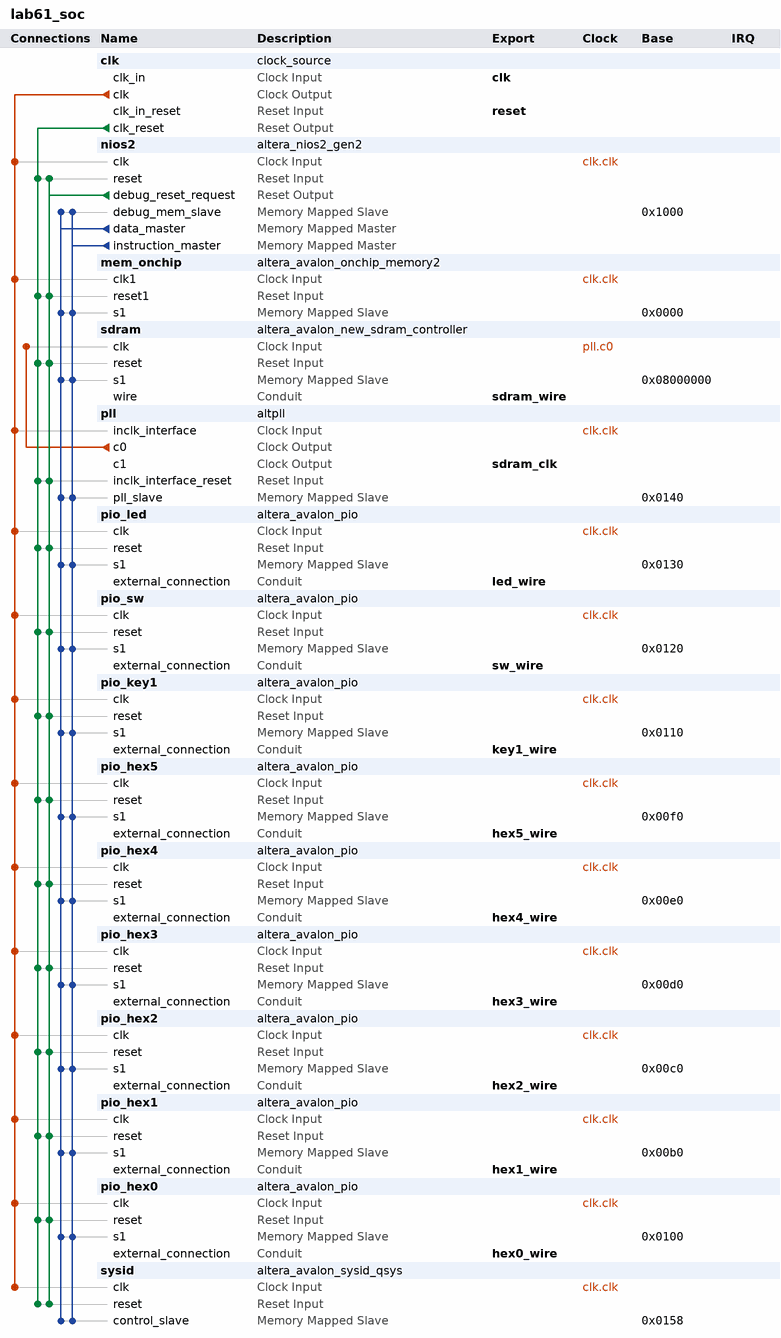
[diagram p0: system contents]
# Platform Designer (Qsys) system lab61_soc, MAX 10 10M50DAF484C7G
# Parameters at their usual value, and those the tool derives, are not listed.
package require -exact qsys 18.1
create_system lab61_soc
set_project_property DEVICE_FAMILY {MAX 10}
set_project_property DEVICE 10M50DAF484C7G

add_instance clk clock_source 18.1
set_instance_parameter_value clk clockFrequency 50000000

add_instance nios2 altera_nios2_gen2 18.1
set_instance_parameter_value nios2 dcache_size 2048
set_instance_parameter_value nios2 exceptionSlave sdram.s1
set_instance_parameter_value nios2 icache_size 4096
set_instance_parameter_value nios2 impl Tiny
set_instance_parameter_value nios2 resetSlave sdram.s1

add_instance mem_onchip altera_avalon_onchip_memory2 18.1
set_instance_parameter_value mem_onchip dataWidth 32
set_instance_parameter_value mem_onchip dualPort false
set_instance_parameter_value mem_onchip initMemContent true
set_instance_parameter_value mem_onchip initializationFileName onchip_mem.hex
set_instance_parameter_value mem_onchip memorySize 16

add_instance sdram altera_avalon_new_sdram_controller 18.1
set_instance_parameter_value sdram TAC 5.4
set_instance_parameter_value sdram TRCD 20.0
set_instance_parameter_value sdram TRP 20.0
set_instance_parameter_value sdram casLatency 3
set_instance_parameter_value sdram columnWidth 10
set_instance_parameter_value sdram dataWidth 16
set_instance_parameter_value sdram generateSimulationModel false
set_instance_parameter_value sdram model single_Micron_MT48LC4M32B2_7_chip
set_instance_parameter_value sdram numberOfBanks 4
set_instance_parameter_value sdram numberOfChipSelects 1
set_instance_parameter_value sdram powerUpDelay 200.0
set_instance_parameter_value sdram refreshPeriod 15.625
set_instance_parameter_value sdram rowWidth 13

add_instance pll altpll 18.1
set_instance_parameter_value pll CLK0_DIVIDE_BY 1
set_instance_parameter_value pll CLK0_MULTIPLY_BY 1
set_instance_parameter_value pll CLK1_DIVIDE_BY 1
set_instance_parameter_value pll CLK1_DUTY_CYCLE 50
set_instance_parameter_value pll CLK1_MULTIPLY_BY 1
set_instance_parameter_value pll CLK1_PHASE_SHIFT -1000
set_instance_parameter_value pll INCLK0_INPUT_FREQUENCY 20000
set_instance_parameter_value pll PORT_ARESET PORT_UNUSED
set_instance_parameter_value pll PORT_LOCKED PORT_UNUSED
set_instance_parameter_value pll PORT_clk1 PORT_USED
set_instance_parameter_value pll PORT_clk2 PORT_UNUSED
set_instance_parameter_value pll PORT_clk3 PORT_UNUSED

add_instance pio_led altera_avalon_pio 18.1
set_instance_parameter_value pio_led direction Output
set_instance_parameter_value pio_led width 8

add_instance pio_sw altera_avalon_pio 18.1
set_instance_parameter_value pio_sw direction Input
set_instance_parameter_value pio_sw width 8

add_instance pio_key1 altera_avalon_pio 18.1
set_instance_parameter_value pio_key1 direction Input
set_instance_parameter_value pio_key1 width 1

add_instance pio_hex5 altera_avalon_pio 18.1
set_instance_parameter_value pio_hex5 direction Output
set_instance_parameter_value pio_hex5 width 8

add_instance pio_hex4 altera_avalon_pio 18.1
set_instance_parameter_value pio_hex4 direction Output
set_instance_parameter_value pio_hex4 width 8

add_instance pio_hex3 altera_avalon_pio 18.1
set_instance_parameter_value pio_hex3 direction Output
set_instance_parameter_value pio_hex3 width 8

add_instance pio_hex2 altera_avalon_pio 18.1
set_instance_parameter_value pio_hex2 direction Output
set_instance_parameter_value pio_hex2 width 8

add_instance pio_hex1 altera_avalon_pio 18.1
set_instance_parameter_value pio_hex1 direction Output
set_instance_parameter_value pio_hex1 width 8

add_instance pio_hex0 altera_avalon_pio 18.1
set_instance_parameter_value pio_hex0 direction Output
set_instance_parameter_value pio_hex0 width 8

add_instance sysid altera_avalon_sysid_qsys 18.1
set_instance_parameter_value sysid id 0

# connections
add_connection clk.clk mem_onchip.clk1 clock
add_connection clk.clk nios2.clk clock
add_connection clk.clk pio_hex0.clk clock
add_connection clk.clk pio_hex1.clk clock
add_connection clk.clk pio_hex2.clk clock
add_connection clk.clk pio_hex3.clk clock
add_connection clk.clk pio_hex4.clk clock
add_connection clk.clk pio_hex5.clk clock
add_connection clk.clk pio_key1.clk clock
add_connection clk.clk pio_led.clk clock
add_connection clk.clk pio_sw.clk clock
add_connection clk.clk pll.inclk_interface clock
add_connection clk.clk sysid.clk clock
add_connection pll.c0 sdram.clk clock
add_connection clk.clk_reset mem_onchip.reset1 reset
add_connection clk.clk_reset nios2.reset reset
add_connection clk.clk_reset pio_hex0.reset reset
add_connection clk.clk_reset pio_hex1.reset reset
add_connection clk.clk_reset pio_hex2.reset reset
add_connection clk.clk_reset pio_hex3.reset reset
add_connection clk.clk_reset pio_hex4.reset reset
add_connection clk.clk_reset pio_hex5.reset reset
add_connection clk.clk_reset pio_key1.reset reset
add_connection clk.clk_reset pio_led.reset reset
add_connection clk.clk_reset pio_sw.reset reset
add_connection clk.clk_reset pll.inclk_interface_reset reset
add_connection clk.clk_reset sdram.reset reset
add_connection clk.clk_reset sysid.reset reset
add_connection nios2.debug_reset_request mem_onchip.reset1 reset
add_connection nios2.debug_reset_request nios2.reset reset
add_connection nios2.debug_reset_request pio_hex0.reset reset
add_connection nios2.debug_reset_request pio_hex1.reset reset
add_connection nios2.debug_reset_request pio_hex2.reset reset
add_connection nios2.debug_reset_request pio_hex3.reset reset
add_connection nios2.debug_reset_request pio_hex4.reset reset
add_connection nios2.debug_reset_request pio_hex5.reset reset
add_connection nios2.debug_reset_request pio_key1.reset reset
add_connection nios2.debug_reset_request pio_led.reset reset
add_connection nios2.debug_reset_request pio_sw.reset reset
add_connection nios2.debug_reset_request pll.inclk_interface_reset reset
add_connection nios2.debug_reset_request sdram.reset reset
add_connection nios2.debug_reset_request sysid.reset reset
add_connection nios2.data_master mem_onchip.s1 avalon
set_connection_parameter_value nios2.data_master/mem_onchip.s1 baseAddress 0x0000
add_connection nios2.data_master nios2.debug_mem_slave avalon
set_connection_parameter_value nios2.data_master/nios2.debug_mem_slave baseAddress 0x1000
add_connection nios2.data_master pio_hex0.s1 avalon
set_connection_parameter_value nios2.data_master/pio_hex0.s1 baseAddress 0x0100
add_connection nios2.data_master pio_hex1.s1 avalon
set_connection_parameter_value nios2.data_master/pio_hex1.s1 baseAddress 0x00b0
add_connection nios2.data_master pio_hex2.s1 avalon
set_connection_parameter_value nios2.data_master/pio_hex2.s1 baseAddress 0x00c0
add_connection nios2.data_master pio_hex3.s1 avalon
set_connection_parameter_value nios2.data_master/pio_hex3.s1 baseAddress 0x00d0
add_connection nios2.data_master pio_hex4.s1 avalon
set_connection_parameter_value nios2.data_master/pio_hex4.s1 baseAddress 0x00e0
add_connection nios2.data_master pio_hex5.s1 avalon
set_connection_parameter_value nios2.data_master/pio_hex5.s1 baseAddress 0x00f0
add_connection nios2.data_master pio_key1.s1 avalon
set_connection_parameter_value nios2.data_master/pio_key1.s1 baseAddress 0x0110
add_connection nios2.data_master pio_led.s1 avalon
set_connection_parameter_value nios2.data_master/pio_led.s1 baseAddress 0x0130
add_connection nios2.data_master pio_sw.s1 avalon
set_connection_parameter_value nios2.data_master/pio_sw.s1 baseAddress 0x0120
add_connection nios2.data_master pll.pll_slave avalon
set_connection_parameter_value nios2.data_master/pll.pll_slave baseAddress 0x0140
add_connection nios2.data_master sdram.s1 avalon
set_connection_parameter_value nios2.data_master/sdram.s1 baseAddress 0x08000000
add_connection nios2.data_master sysid.control_slave avalon
set_connection_parameter_value nios2.data_master/sysid.control_slave baseAddress 0x0158
add_connection nios2.instruction_master mem_onchip.s1 avalon
set_connection_parameter_value nios2.instruction_master/mem_onchip.s1 baseAddress 0x0000
add_connection nios2.instruction_master nios2.debug_mem_slave avalon
set_connection_parameter_value nios2.instruction_master/nios2.debug_mem_slave baseAddress 0x1000
add_connection nios2.instruction_master pio_hex0.s1 avalon
set_connection_parameter_value nios2.instruction_master/pio_hex0.s1 baseAddress 0x0100
add_connection nios2.instruction_master pio_hex1.s1 avalon
set_connection_parameter_value nios2.instruction_master/pio_hex1.s1 baseAddress 0x00b0
add_connection nios2.instruction_master pio_hex2.s1 avalon
set_connection_parameter_value nios2.instruction_master/pio_hex2.s1 baseAddress 0x00c0
add_connection nios2.instruction_master pio_hex3.s1 avalon
set_connection_parameter_value nios2.instruction_master/pio_hex3.s1 baseAddress 0x00d0
add_connection nios2.instruction_master pio_hex4.s1 avalon
set_connection_parameter_value nios2.instruction_master/pio_hex4.s1 baseAddress 0x00e0
add_connection nios2.instruction_master pio_hex5.s1 avalon
set_connection_parameter_value nios2.instruction_master/pio_hex5.s1 baseAddress 0x00f0
add_connection nios2.instruction_master pio_key1.s1 avalon
set_connection_parameter_value nios2.instruction_master/pio_key1.s1 baseAddress 0x0110
add_connection nios2.instruction_master pio_led.s1 avalon
set_connection_parameter_value nios2.instruction_master/pio_led.s1 baseAddress 0x0130
add_connection nios2.instruction_master pio_sw.s1 avalon
set_connection_parameter_value nios2.instruction_master/pio_sw.s1 baseAddress 0x0120
add_connection nios2.instruction_master pll.pll_slave avalon
set_connection_parameter_value nios2.instruction_master/pll.pll_slave baseAddress 0x0140
add_connection nios2.instruction_master sdram.s1 avalon
set_connection_parameter_value nios2.instruction_master/sdram.s1 baseAddress 0x08000000
add_connection nios2.instruction_master sysid.control_slave avalon
set_connection_parameter_value nios2.instruction_master/sysid.control_slave baseAddress 0x0158

# exported interfaces
add_interface clk clock sink
set_interface_property clk EXPORT_OF clk.clk_in
add_interface hex0_wire conduit end
set_interface_property hex0_wire EXPORT_OF pio_hex0.external_connection
add_interface hex1_wire conduit end
set_interface_property hex1_wire EXPORT_OF pio_hex1.external_connection
add_interface hex2_wire conduit end
set_interface_property hex2_wire EXPORT_OF pio_hex2.external_connection
add_interface hex3_wire conduit end
set_interface_property hex3_wire EXPORT_OF pio_hex3.external_connection
add_interface hex4_wire conduit end
set_interface_property hex4_wire EXPORT_OF pio_hex4.external_connection
add_interface hex5_wire conduit end
set_interface_property hex5_wire EXPORT_OF pio_hex5.external_connection
add_interface key1_wire conduit end
set_interface_property key1_wire EXPORT_OF pio_key1.external_connection
add_interface led_wire conduit end
set_interface_property led_wire EXPORT_OF pio_led.external_connection
add_interface reset reset sink
set_interface_property reset EXPORT_OF clk.clk_in_reset
add_interface sdram_clk clock source
set_interface_property sdram_clk EXPORT_OF pll.c1
add_interface sdram_wire conduit end
set_interface_property sdram_wire EXPORT_OF sdram.wire
add_interface sw_wire conduit end
set_interface_property sw_wire EXPORT_OF pio_sw.external_connection

set_interconnect_requirement {$system} qsys_mm.clockCrossingAdapter HANDSHAKE
set_interconnect_requirement {$system} qsys_mm.enableEccProtection FALSE
set_interconnect_requirement {$system} qsys_mm.insertDefaultSlave FALSE
set_interconnect_requirement {$system} qsys_mm.maxAdditionalLatency 1

save_system lab61_soc.qsys
